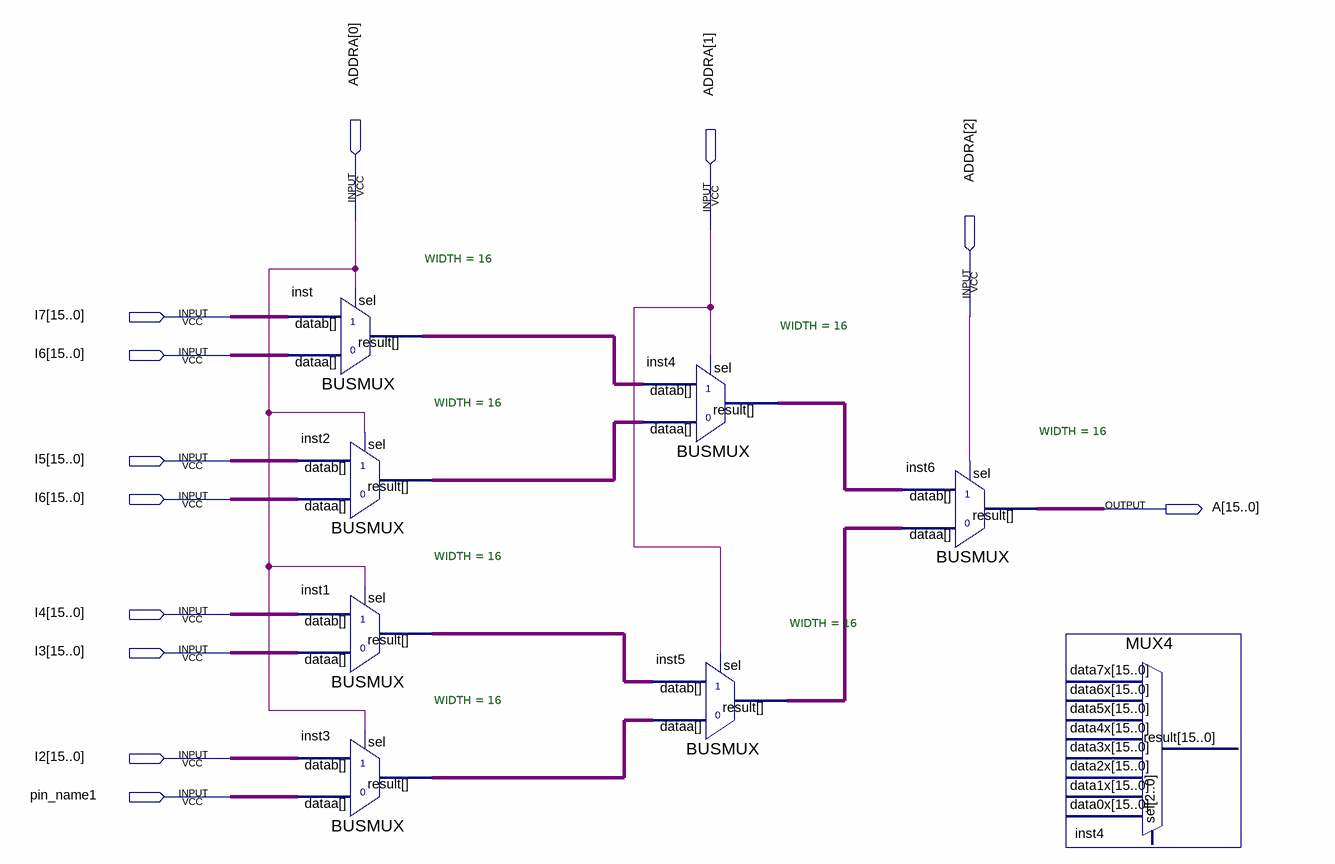
[diagram p0: schematic sheet]
// Quartus schematic Read.bdf as structural Verilog: 8 symbols, 12 pins
module Read (
  input  [2:0] ADDRA,
  input  [15:0] I7,
  input  [15:0] I6,
  input  [15:0] I5,
  input  [15:0] I4,
  input  [15:0] I3,
  input  [15:0] I2,
  input  pin_name1,
  output [15:0] A
);

  wire [15:0] inst1_result, inst2_result, inst3_result, inst4_result, inst5_result, inst_result, undriven;

  BUSMUX #(.WIDTH(16)) inst (.dataa(I6), .datab(I7), .sel(ADDRA[0]), .result(inst_result));
  BUSMUX #(.WIDTH(16)) inst2 (.dataa(I6), .datab(I5), .sel(ADDRA[0]), .result(inst2_result));
  BUSMUX #(.WIDTH(16)) inst1 (.dataa(I3), .datab(I4), .sel(ADDRA[0]), .result(inst1_result));
  BUSMUX #(.WIDTH(16)) inst3 (.dataa(undriven), .datab(I2), .sel(ADDRA[0]), .result(inst3_result));
  BUSMUX #(.WIDTH(16)) inst4 (.dataa(inst2_result), .datab(inst_result), .sel(ADDRA[1]), .result(inst4_result));
  BUSMUX #(.WIDTH(16)) inst5 (.dataa(inst3_result), .datab(inst1_result), .sel(ADDRA[1]), .result(inst5_result));
  BUSMUX #(.WIDTH(16)) inst6 (.dataa(inst5_result), .datab(inst4_result), .sel(ADDRA[2]), .result(A));
  MUX4 inst4_dup2 ();  // open: data7x, data6x, data5x, data4x, data3x, data2x, data1x, data0x, sel, result
endmodule
